# Altium project PCB.PrjPCB
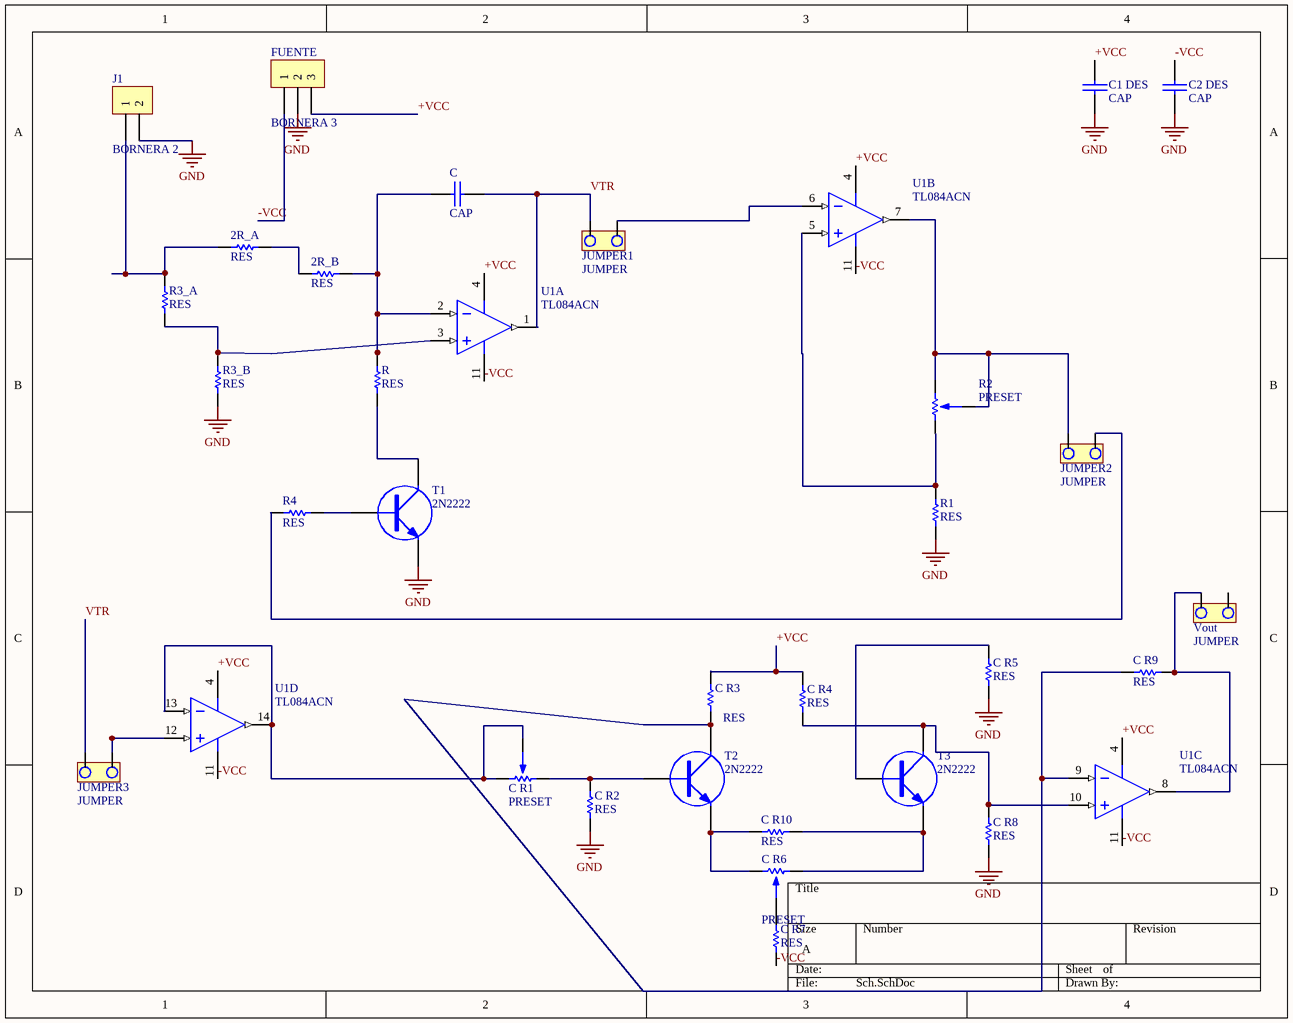
[diagram p0: Sch.SchDoc]
1 sheet, 31 parts. Net scope: global (net labels, ports and power ports of the same name join across sheets).
Board file: PCB1.PcbDoc

## Sheet Sch.SchDoc
size A

### Parts
2R_A  RES  [0805]
2R_B  RES  [0805]
C  CAP  [0805]
C1_DES  CAP  [0805]
C2_DES  CAP  [0805]
C_R1  PRESET  [PRESET V]
C_R2  RES  [0805]
C_R3  RES  [0805]
C_R4  RES  [0805]
C_R5  RES  [0805]
C_R6  PRESET  [PRESET V]
C_R7  RES  [0805]
C_R8  RES  [0805]
C_R9  RES  [0805]
C_R10  RES  [0805]
FUENTE  BORNERA 3  [BORNERA3]
J1  BORNERA 2  [BORNERA2]
JUMPER1  JUMPER  [JUMPER2]
JUMPER2  JUMPER  [JUMPER2]
JUMPER3  JUMPER  [JUMPER2]
R  RES  [0805]
R1  RES  [0805]
R2  PRESET  [PRESET V]
R3_A  RES  [0805]
R3_B  RES  [0805]
R4  RES  [0805]
T1  2N2222  [TO18]
T2  2N2222  [TO18]
T3  2N2222  [TO18]
U1  TL084ACN  [TI-N14]  (parts A,B,C,D of 4)
Vout  JUMPER  [JUMPER2]

### Nets
GND: C1_DES.1 C2_DES.1 C_R2.1 C_R5.1 C_R8.1 FUENTE.2 J1.2 R1.1 R3_B.1 T1.2(E)
+VCC: C1_DES.2 C_R3.2 C_R4.2 FUENTE.3 U1.4(VCC+)
-VCC: C2_DES.2 C_R7.2 FUENTE.1 U1.11(VCC-)
VTR: C.2 JUMPER1.1 JUMPER3.1 U1.1(OUT1)
Net2R_A_1: 2R_A.1 J1.1 R3_A.2
Net2R_A_2: 2R_A.2 2R_B.1
Net2R_B_2: 2R_B.2 C.1 R.2 U1.2(IN1-)
NetC_R1_1: C_R1.1 C_R1.2 U1.13(IN4-) U1.14(OUT4)
NetC_R1_3: C_R1.3 C_R2.2 T2.1(B)
NetC_R3_1: C_R3.1 C_R9.2 T2.3(C) U1.9(IN3-)
NetC_R4_1: C_R4.1 C_R8.2 T3.3(C) U1.10(IN3+)
NetC_R5_2: C_R5.2 T3.1(B)
NetC_R6_1: C_R6.1 C_R10.1 T3.2(E)
NetC_R6_2: C_R6.2 C_R7.1
NetC_R6_3: C_R6.3 C_R10.2 T2.2(E)
NetC_R9_1: C_R9.1 U1.8(OUT3) Vout.1
NetJUMPER1_2: JUMPER1.2 U1.6(IN2-)
NetJUMPER2_1: JUMPER2.1 R2.1 R2.2 U1.7(OUT2)
NetJUMPER2_2: JUMPER2.2 R4.2
NetJUMPER3_2: JUMPER3.2 U1.12(IN4+)
NetR1_2: R1.2 R2.3 U1.5(IN2+)
NetR3_A_1: R3_A.1 R3_B.2 U1.3(IN1+)
NetR4_1: R4.1 T1.1(B)
NetR_1: R.1 T1.3(C)

Not connected (* = marked no-connect by the designer): Vout 2

### Library data of the parts
U1 = TL084ACN: JFET-Input Operational Amplifier, 7 to 36 V, 0 to 70 degC, 14-pin DIP (N14), Pb-Free (RoHS); Manufacturer: Texas Instruments; CMRR(Min)(dB): 75; GBW(Typ)(MHz): 3; IIB(Max)(pA): 200; Iq per channel(Max)(mA): 2.8; Number of Channels: 4; Offset Drift(Typ)(uV/C): 18; Rating: Catalog; Slew Rate(Typ)(V/us): 13; Sub Family: General Purpose Amplifier, High Supply Voltage Amplifier (>=30V); Total Supply Voltage(Max)(+5V is 5, +/-5V is 10): 36; Total Supply Voltage(Min)(+5V is 5, +/-5V is 10): 7; Vio (25C)(Max)(mV): 6; DatasheetVersion: SLOS081G; PackageVersion: 4040049/E, 12/2002; PackageReference: N14; PackageDescription: 14-Pin Plastic In-Line, Body 19.305 x 6.35 mm, Pitch 2.54 mm; Supplier 1: Digi-Key; Supplier Part Number 1: 296-1782-5-ND; Supplier 2: Farnell; Supplier Part Number 2: 1106129; Supplier 3: Newark; Supplier Part Number 3: 08F9361; Supplier 4: Mouser; Supplier Part Number 4: 595-TL084ACN; Eco-Plan: Pb-Free (RoHS); Vn at 1kHz(Typ)(nV/rtHz): 18; Mounting Technology: Through Hole; Code_JEDEC: MS-001; PartNumber: TL084ACN; ComponentLink1Description: Manufacturer URL; ComponentLink1URL: http://www.ti.com/; ComponentLink2Description: Datasheet; ComponentLink2URL: http://www.ti.com/lit/ds/symlink/tl084a.pdf; ComponentLink3Description: Package Specification; ComponentLink3URL: http://www.ti.com/lit/ml/mpdi002c/mpdi002c.pdf